# Altium schematic sheet Filter and output.SchDoc
size A4; DocumentNumber: 2; SheetNumber: 2; SheetTotal: 4
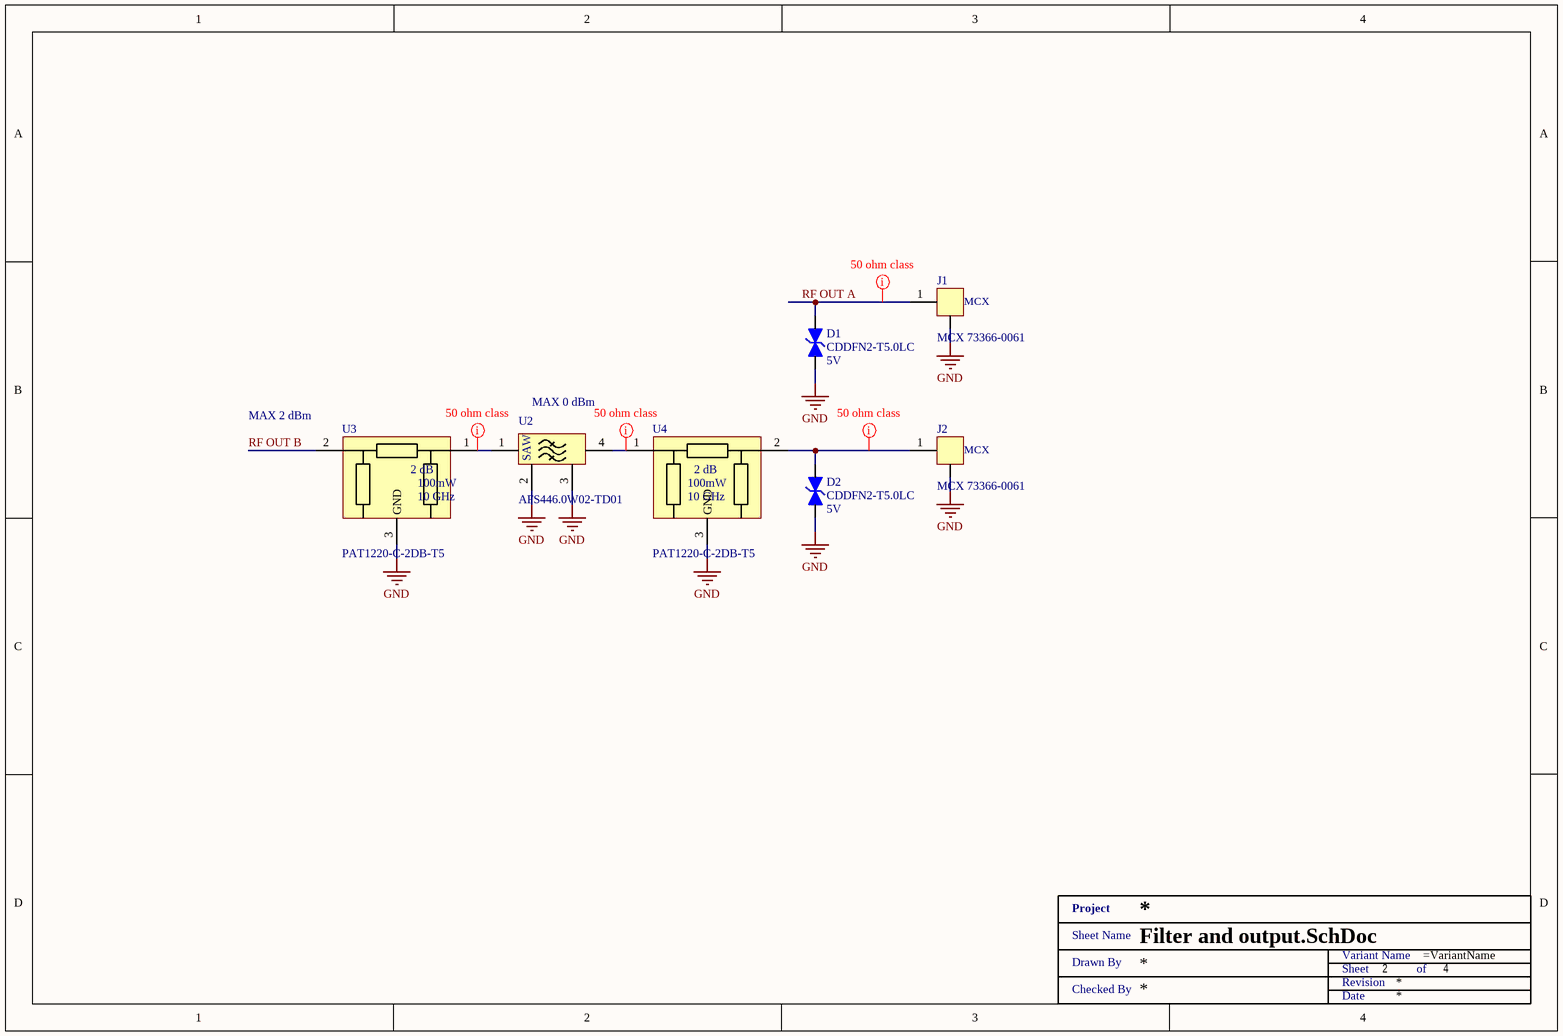
[diagram p0: Filter and output.SchDoc]

## Parts
D1  CDDFN2-T5.0LC  Operating Supply Voltage: 5V  [CDDFN2-T5.0LC]
D2  CDDFN2-T5.0LC  Operating Supply Voltage: 5V  [CDDFN2-T5.0LC]
J1  MCX 73366-0061  [73366-0061]
J2  MCX 73366-0061  [73366-0061]
U2  AFS446.0W02-TD01  [AFS446.0W02-TD01]
U3  PAT1220-C-2DB-T5  [PAT1220]
U4  PAT1220-C-2DB-T5  [PAT1220]
XX?  Title 1  (value not drawn)  (graphical)

## Nets
GND: D1.2 D2.2 J1.2(GND) J2.2(GND) U2.2(GND) U2.3(GND) U3.3(GND) U4.3(GND)
RF OUT A: D1.1 J1.1(INPUT)
RF OUT B: U3.2
NetD2_1: D2.1 J2.1(INPUT) U4.2
NetU2_1: U2.1(IN) U3.1
NetU2_4: U2.4(OUT) U4.1

## Layout directives
net class 50 ohm: NetD2_1, NetU2_1, NetU2_4, RF OUT A

## Notes on the sheet
- (near U3) MAX 2 dBm
- (near U2) MAX 0 dBm
- (in symbol AFS446.0W02-TD01) SAW
- (in symbol PAT1220-C-2DB-T5) 2 dB; 10 GHz
- (in symbol Title 1) Project; Sheet Name; Variant Name; Drawn By; Sheet; of; Revision; Checked By; Date

## Library data of the parts
D1 D2 = CDDFN2-T5.0LC: TVS DIODE 5VWM 25VC DFN2; Manufacturer: Bourns; Direction: Bidirectional; Max Surge Current: 5A; Breakdown Voltage: 7V; Clamping Voltage: 15V; Number of Channels: 1; Power Line Protection: No; Leakage Current: 1uA; Diode Type: ZENER; Capacitance: 12pF; Element Configuration: Single; Supplier 1: Mouser; Supplier Part Number 1: 652-CDDFN2-T5.0LC; Manufacturer Part Number: CDDFN2-T5.0LC; RoHS: Yes; Category: TVS Diodes; Stock 1: 37803; Pricing 1: 1=0.43000, 10=0.34500, 50=0.34500, 100=0.24100, 1000=0.15700, 10000=0.14100 (USD); Mount: Surface Mount; Case/Package: DFN; Number of Pins: 2; Contact Plating: Gold; Min Operating Temperature: -40°C; Max Operating Temperature: 85°C; Packaging: Tape and Reel; Package Quantity: 1; Polarity: Bidirectional; Termination: SMD/SMT; Reverse Standoff Voltage: 5V; Number of Bidirectional Channels: 1; Min Breakdown Voltage: 7V; Working Voltage: 5V; Resistor Type: Zener; Series: -; Max Breakdown Voltage: 7V; Length: 1mm; Radiation Hardening: No; RoHS Compliant: Yes; REACH SVHC: No SVHC; ComponentLink1URL: https://datasheet.ciiva.com/6817/1758341-6817680.pdf?src-supplier=Newark; ComponentLink1Description: https://datasheet.ciiva.com/6817/1758341-6817680.pdf?src-supplier=Newark; ComponentLink2URL: https://datasheet.ciiva.com/11193/cddfn2-t5-0lc-11193904.pdf?src-supplier=Avnet; ComponentLink2Description: https://datasheet.ciiva.com/11193/cddfn2-t5-0lc-11193904.pdf?src-supplier=Avnet; ComponentLink3URL: https://datasheet.ciiva.com/4507/cddfn2-txxc-71882-4507683.pdf?src-supplier=Mouser; ComponentLink3Description: https://datasheet.ciiva.com/4507/cddfn2-txxc-71882-4507683.pdf?src-supplier=Mouser; ComponentLink4URL: https://datasheet.ciiva.com/335/cddfn2-t5-0lc-335432.pdf?src-supplier=Digi-Key; ComponentLink4Description: https://datasheet.ciiva.com/335/cddfn2-t5-0lc-335432.pdf?src-supplier=Digi-Key; ComponentLink5URL: https://datasheet.ciiva.com/335/cddfn2-t5-0lc-335433.pdf?src-supplier=Digi-Key; ComponentLink5Description: https://datasheet.ciiva.com/335/cddfn2-t5-0lc-335433.pdf?src-supplier=Digi-Key; ComponentLink6URL: https://datasheet.ciiva.com/335/cddfn2-t5-0lc-335434.pdf?src-supplier=Digi-Key; ComponentLink6Description: https://datasheet.ciiva.com/335/cddfn2-t5-0lc-335434.pdf?src-supplier=Digi-Key; Supplier 2: Farnell; Supplier Part Number 2: 1860785; Supplier 3: Digi-Key; Supplier Part Number 3: CDDFN2-T5.0LCCT-ND; Supplier 4: Arrow Electronics; Supplier Part Number 4: CDDFN2-T5.0LC
J1 J2 = 73366-0061: CONN MCX JACK STR 50 OHM PCB; Manufacturer: Molex, LLC; Manufacturer Part Number: 0733660061; Connector Type: Jack, Female Socket; Contact Termination: Solder; Impedance: 50 Ohm; Body Material: Brass; Body Finish: Gold; Dielectric Material: Polytetrafluoroethylene (PTFE); Center Contact Material: Beryllium Copper; Mating Cycles: 500; RoHS: RoHS Compliant; Category: Connectors, Interconnects; Stock 1: 39394; Pricing 1: 1=1.95, 10=1.765, 25=1.6572, 50=1.5854, 100=1.5133, 250=1.36916, 500=1.26106, 1000=1.0809, 2500=1.00884 (USD); Packaging: Tray; Part Status: Active; Connector Style: MCX; Shield Termination: Solder; Mounting Type: Through Hole; Mounting Feature: -; Cable Group: -; Fastening Type: Snap-On; Features: -; Housing Color: Gold; Ingress Protection: -; Includes: -; Center Contact Plating: Gold; Operating Temperature: -55°C ~ 155°C; Insertion Loss: -; ComponentLink1URL: https://www.molex.com/pdm_docs/sd/733660061_sd.pdf; ComponentLink1Description: https://www.molex.com/pdm_docs/sd/733660061_sd.pdf; Supplier 1: Mouser; Supplier Part Number 1: 538-73366-0061; Supplier 2: Digi-Key; Supplier Part Number 2: WM5541-ND; Supplier 3: Farnell; Supplier Part Number 3: 1909245
U2 = AFS446.0W02-TD01: Saw Filters 446MHz; Manufacturer: Abracon; Voltage Rating (DC): 10V; Impedance: 50R; Insertion Loss: 4.5dB; Supplier 1: Mouser; Supplier Part Number 1: 815-AFS446.0W2-TD1; Manufacturer Part Number: AFS446.0W02-TD01; RoHS: Yes; Category: EMI / RFI Components; Stock 1: 608; Pricing 1: 1=0.93000, 10=0.85800, 50=0.70100, 100=0.57200, 1000=0.48600, 10000=0.34600 (USD); Min Operating Temperature: -40°C; Max Operating Temperature: 80°C; Frequency: 446MHz; Termination: Radial; RoHS Compliant: Yes; ComponentLink1URL: https://datasheet.ciiva.com/4548/afs446-0w02-td01-43048-4548368.pdf?src-supplier=Mouser; ComponentLink1Description: https://datasheet.ciiva.com/4548/afs446-0w02-td01-43048-4548368.pdf?src-supplier=Mouser
U3 U4 = PAT1220-C-2DB-T5: Chip Attenuator 10GHz 2dB, 100mW; Manufacturer: Susumu; Impedance: 50R; Supplier 1: Mouser; Supplier Part Number 1: 754-PAT1220C-2DBT5; Manufacturer Part Number: PAT1220-C-2DB-T5; RoHS: Yes; Category: Uncategorized; Stock 1: 17229; Pricing 1: 1=0.35000, 10=0.30800, 25=0.27800, 100=0.24300, 250=0.21300, 500=0.18800, 1000=0.14800, 5000=0.12500, 10000=0.12000 (USD); Mount: Surface Mount; Case/Package: 0805; Number of Pins: 3; Case Code (Imperial): 0805; Case Code (Metric): 2012; Min Operating Temperature: -55°C; Max Operating Temperature: 125°C; Packaging: Tape and Reel; Package Quantity: 1; Max Power Dissipation: 100mW; Attenuation Value: 2dB; Frequency: 10GHz; Power Rating: 100mW; Lead Free: Lead Free; ComponentLink1URL: https://datasheet.ciiva.com/15101/getdatasheetpartid-497046-15101143.pdf?src-supplier=Verical; ComponentLink1Description: https://datasheet.ciiva.com/15101/getdatasheetpartid-497046-15101143.pdf?src-supplier=Verical; ComponentLink2URL: https://datasheet.ciiva.com/2788/products-38-2788379.pdf?src-supplier=Digi-Key; ComponentLink2Description: https://datasheet.ciiva.com/2788/products-38-2788379.pdf?src-supplier=Digi-Key; ComponentLink3URL: https://datasheet.ciiva.com/24156/products-38-24156863.pdf?src-supplier=Future+Electronics; ComponentLink3Description: https://datasheet.ciiva.com/24156/products-38-24156863.pdf?src-supplier=Future+Electronics; ComponentLink4URL: https://datasheet.ciiva.com/2788/products-38-2788377.pdf?src-supplier=Digi-Key; ComponentLink4Description: https://datasheet.ciiva.com/2788/products-38-2788377.pdf?src-supplier=Digi-Key; ComponentLink5URL: https://datasheet.ciiva.com/2788/products-38-2788378.pdf?src-supplier=Digi-Key; ComponentLink5Description: https://datasheet.ciiva.com/2788/products-38-2788378.pdf?src-supplier=Digi-Key